# Altium schematic sheet 各路供电与接口.SchDoc
size A4
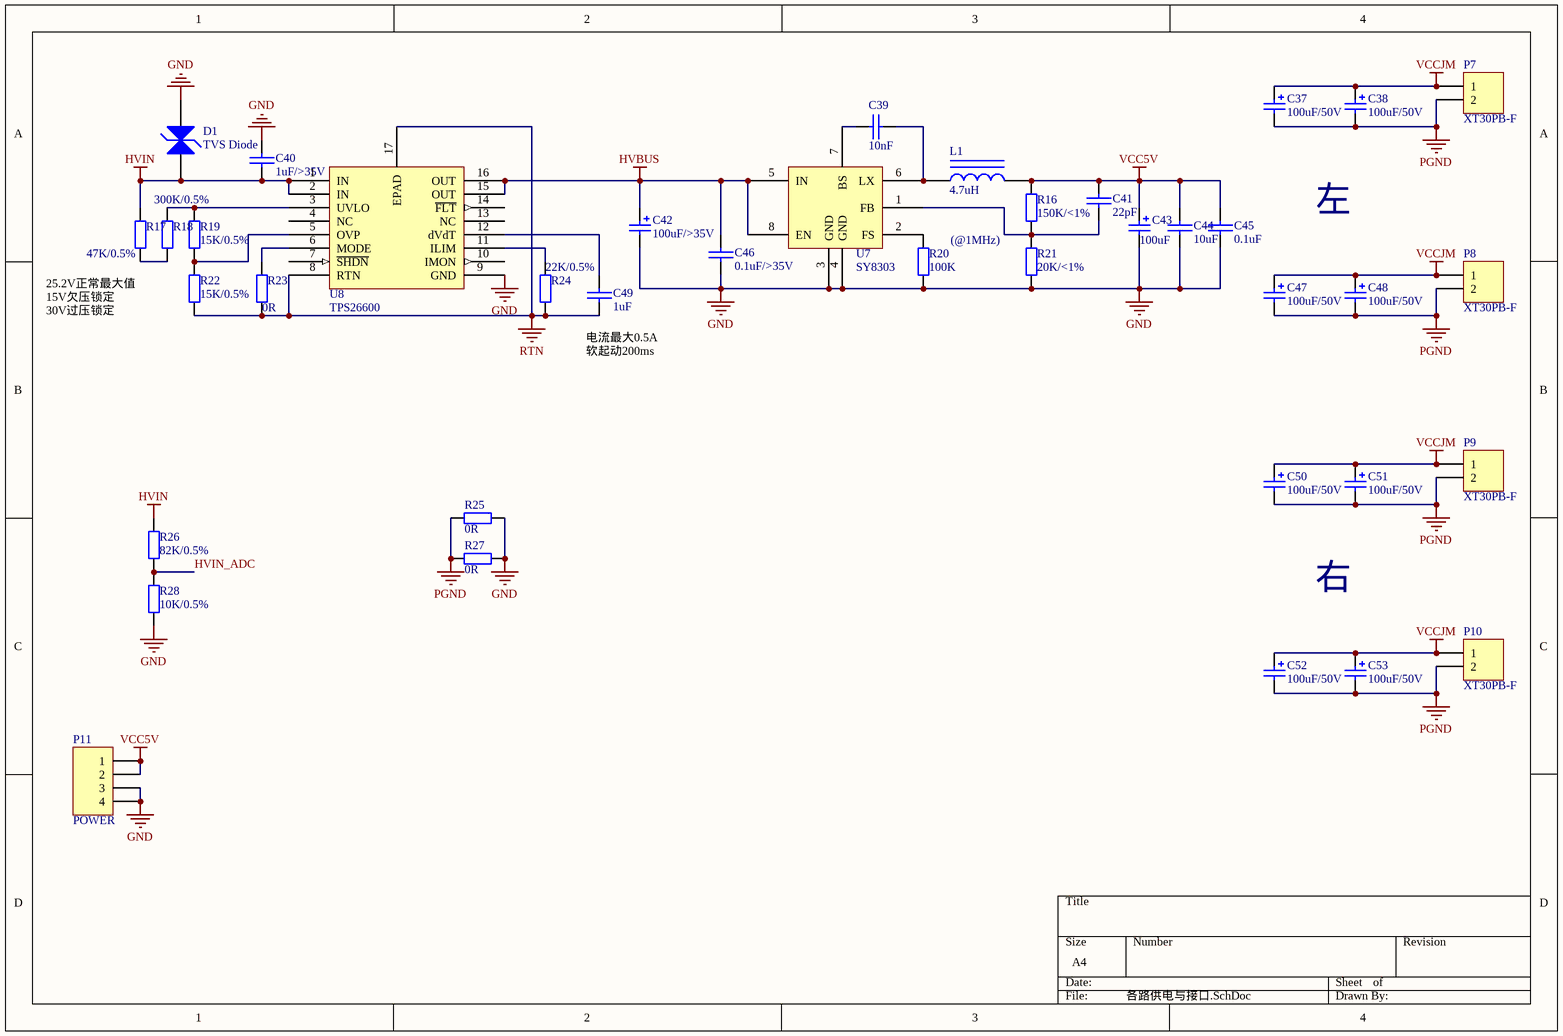
[diagram p0: 各路供电与接口.SchDoc]

## Parts
C37  100uF/50V  [CS 6*6 - R]
C38  100uF/50V  [CS 6*6 - R]
C39  10nF  [C0805_M]
C40  1uF/>35V  [C0805_M]
C41  22pF  [C0805_M]
C42  100uF/>35V  [CS 6*6 - R]
C43  100uF  [CS 6*6 - R]
C44  10uF  [C0805_M]
C45  0.1uF  [C0805_M]
C46  0.1uF/>35V  [C0805_M]
C47  100uF/50V  [CS 6*6 - R]
C48  100uF/50V  [CS 6*6 - R]
C49  1uF  [C0805_M]
C50  100uF/50V  [CS 6*6 - R]
C51  100uF/50V  [CS 6*6 - R]
C52  100uF/50V  [CS 6*6 - R]
C53  100uF/50V  [CS 6*6 - R]
D1  TVS Diode  [SMB]
L1  4.7uH  [L-SMD-0630]
P7  XT30PB-F  [XT30PB-F]
P8  XT30PB-F  [XT30PB-F]
P9  XT30PB-F  [XT30PB-F]
P10  XT30PB-F  [XT30PB-F]
P11  POWER  [XH2.54-LI-4P]
R16  150K/<1%  [R0805_M]
R17  47K/0.5%  [R0805_M]
R18  300K/0.5%  [R0805_M]
R19  15K/0.5%  [R0805_M]
R20  100K  [R0805_M]
R21  20K/<1%  [R0805_M]
R22  15K/0.5%  [R0805_M]
R23  0R  [R0805_M]
R24  22K/0.5%  [R0805_M]
R25  0R  [R0805_M]
R26  82K/0.5%  [R0805_M]
R27  0R  [R0805_M]
R28  10K/0.5%  [R0805_M]
U7  SY8303  [SOT23-8L]
U8  TPS26600  [ETSSOP16_M]

## Nets
GND: C40.2 C42.2 C43.2 C44.1 C45.1 C46.1 D1.2(K) P11.3 P11.4 R20.2 R21.2 R25.2 R27.2 R28.2 U7.3(GND) U7.4(GND) U8.9(GND)
HVBUS: C42.1 C46.2 U7.5(IN) U7.8(EN) U8.15(OUT) U8.16(OUT)
HVIN: C40.1 D1.1(A) R17.1 R26.1 U8.1(IN) U8.2(IN)
PGND: C37.2 C38.2 C47.2 C48.2 C50.2 C51.2 C52.2 C53.2 P7.2 P8.2 P9.2 P10.2 R25.1 R27.1
RTN: C49.2 R22.2 R23.2 R24.2 U8.8(RTN) U8.17(EPAD)
VCC5V: C41.2 C43.1 C44.2 C45.2 L1.2 P11.1 P11.2 R16.1
VCCJM: C37.1 C38.1 C47.1 C48.1 C50.1 C51.1 C52.1 C53.1 P7.1 P8.1 P9.1 P10.1
HVIN_ADC: R26.2 R28.1
NetC39_1: C39.1 U7.7(BS)
NetC39_2: C39.2 L1.1 U7.6(LX)
NetC41_1: C41.1 R16.2 R21.1 U7.1(FB)
NetC49_1: C49.1 U8.12(dVdT)
NetR17_2: R17.2 R18.2
NetR18_1: R18.1 R19.1 U8.3(UVLO)
NetR19_2: R19.2 R22.1 U8.5(OVP)
NetR20_1: R20.1 U7.2(FS)
NetR23_1: R23.1 U8.6(MODE)
NetR24_1: R24.1 U8.11(ILIM)

Not connected (* = marked no-connect by the designer): U8 4(NC) 7(~{SHDN}) 10(IMON) 13(NC) 14(~{FLT})

## Notes on the sheet
- (@1MHz)
- 左
- 25.2V正常最大值
  15V欠压锁定
  30V过压锁定
- (near C49) 电流最大0.5A
  软起动200ms
- 右

## Library data of the parts
C37 C38 C47 C48 C50-C53 = Cap Pol2: Low ESR required; Published: 8-Jun-2000; LatestRevisionDate: 17-Jul-2002; LatestRevisionNote: Re-released for DXP Platform.; PackageReference: POLAR0.8; Publisher: Altium Limited; PackageDescription: Polarized Capacitor; 2 Leads
C39-C41 C44-C46 C49 = CAP: Capacitor
C42 C43 = Cap Pol2: 固态电容; Published: 8-Jun-2000; LatestRevisionDate: 17-Jul-2002; LatestRevisionNote: Re-released for DXP Platform.; PackageReference: POLAR0.8; Publisher: Altium Limited; PackageDescription: Polarized Capacitor; 2 Leads
D1 = TVS
L1 = Inductor Iron: Magnetic-Core Inductor; Value: 10mH; Published: 24-Mar-1999; LatestRevisionDate: 17-Jul-2002; LatestRevisionNote: Re-released for DXP Platform.; PackageReference: AXIAL-0.9; Publisher: Altium Limited; PackageDescription: Axial Device, Thru-Hole; 2 Leads; 0.9 in Pin Spacing
P7-P10 = Header 2: Header, 2-Pin; LatestRevisionDate: 17-Jul-2002; LatestRevisionNote: Re-released for DXP Platform.; Publisher: Altium Limited
P11 = Header 4: Header, 4-Pin; LatestRevisionDate: 17-Jul-2002; LatestRevisionNote: Re-released for DXP Platform.; Publisher: Altium Limited
R16-R28 = Res2: Resistor; Value: 1K; Published: 8-Jun-2000; LatestRevisionDate: 17-Jul-2002; LatestRevisionNote: Re-released for DXP Platform.; PackageReference: AXIAL-0.4; Publisher: Altium Limited; PackageDescription: Axial Device, Thru-Hole; 2 Leads; 0.4 in Pin Spacing